# Altium schematic sheet AD834_Mixer.SchDoc
size A4; SheetNumber: 4; SheetTotal: 9
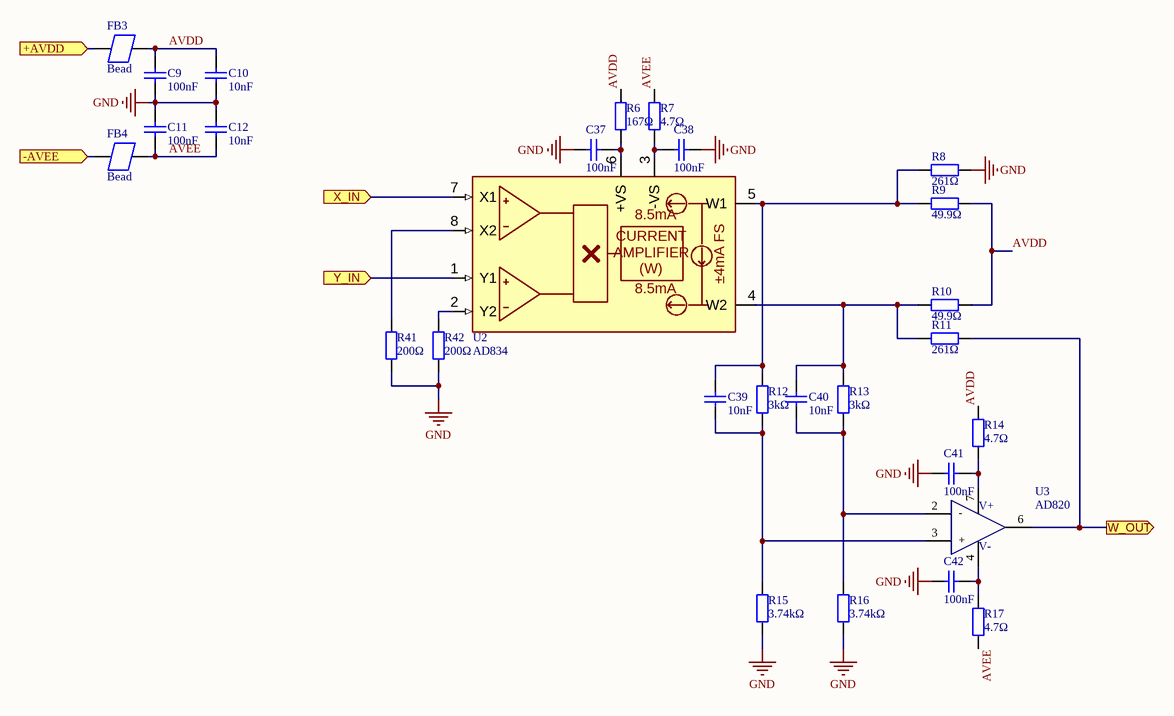
[diagram p0: AD834_Mixer.SchDoc]

## Parts
C9  100nF  [0603_C]
C10  10nF  [0603_C]
C11  100nF  [0603_C]
C12  10nF  [0603_C]
C37  100nF  [0603_C]
C38  100nF  [0603_C]
C39  10nF  [0603_C]
C40  10nF  [0603_C]
C41  100nF  [0603_C]
C42  100nF  [0603_C]
FB3  Bead  [0805_L]
FB4  Bead  [0805_L]
R6  167Ω  [0603_R]
R7  4.7Ω  [0603_R]
R8  261Ω  [0603_R]
R9  49.9Ω  [0603_R]
R10  49.9Ω  [0603_R]
R11  261Ω  [0603_R]
R12  3kΩ  [0603_R]
R13  3kΩ  [0603_R]
R14  4.7Ω  [0603_R]
R15  3.74kΩ  [0603_R]
R16  3.74kΩ  [0603_R]
R17  4.7Ω  [0603_R]
R41  200Ω  [0603_R]
R42  200Ω  [0603_R]
U2  AD834  [SOIC127P600X175-8M]
U3  AD820  [SOIC127P600X175-8M]

## Ports
+AVDD (in), -AVEE (in), W_OUT (out), X_IN (in), Y_IN (in)

## Nets
GND: C9.1 C10.1 C11.1 C12.1 C37.1 C38.1 C41.2 C42.2 R8.1 R15.1 R16.1 R41.1 R42.1
+AVDD: FB3.1 ; port +AVDD
-AVEE: FB4.1 ; port -AVEE
AVDD: C9.2 C10.2 FB3.2 R6.1 R9.1 R10.1 R14.1
AVEE: C11.2 C12.2 FB4.2 R7.1 R17.2
W_OUT: R11.1 U3.6 ; port W_OUT
X_IN: U2.7(X1) ; port X_IN
Y_IN: U2.1(Y1) ; port Y_IN
NetC37_2: C37.2 R6.2 U2.6(+VS)
NetC38_2: C38.2 R7.2 U2.3(-VS)
NetC39_1: C39.1 R12.1 R15.2 U3.3
NetC39_2: C39.2 R8.2 R9.2 R12.2 U2.5(W1)
NetC40_1: C40.1 R13.1 R16.2 U3.2
NetC40_2: C40.2 R10.2 R11.2 R13.2 U2.4(W2)
NetC41_1: C41.1 R14.2 U3.7(VCC+)
NetC42_1: C42.1 R17.1 U3.4(VCC-)
NetR41_2: R41.2 U2.8(X2)
NetR42_2: R42.2 U2.2(Y2)

## Notes on the sheet
- (in symbol AD834) 8.5mA; CURRENT / AMPLIFIER / (W); ±4mA FS
- (in symbol OPA189) V+; -; +; V-

## Library data of the parts
C9 C11 C37 C38 C41 C42 = 0603 100nF (104) 10% 50V: 贴片电容; ComponentLink1Description: 供应商链接; ComponentLink1URL: http://www.szlcsc.com/product/details_15331.html; Package: 0603; Supplier: LC; SuppliersPartNumber: C14663
C10 C12 C39 C40 = 0603 10nF (103) 10% 50V: 贴片电容; ComponentLink1Description: 供应商链接; ComponentLink1URL: http://www.szlcsc.com/product/details_58143.html; Package: 0603; Supplier: LC; SuppliersPartNumber: C57112
R6-R11 R14 R17 = 0603 49.9Ω (49R9) 1%: 贴片电阻; ComponentLink1Description: 供应商链接; ComponentLink1URL: http://www.szlcsc.com/product/details_23912.html; Package: 0603; Supplier: LC; SuppliersPartNumber: C23185
R12 R13 R15 R16 = 0603 3KΩ (3001) 1%: 贴片电阻; ComponentLink1Description: 供应商链接; ComponentLink1URL: http://www.szlcsc.com/product/details_4618.html; Package: 0603; Supplier: LC; SuppliersPartNumber: C4211
R41 R42 = 0603 200Ω (2000) 1%: 贴片电阻; ComponentLink1Description: 供应商链接; ComponentLink1URL: http://www.szlcsc.com/product/details_8708.html; Package: 0603; Supplier: LC; SuppliersPartNumber: C8218
U3 = OPA189: 单路、14MHz、多路复用器友好型、低噪声、零漂移、RRO、CMOS 精密运算放大器